# Altium schematic sheet moi.SchDoc
size A3; SheetNumber: 1; SheetTotal: 1
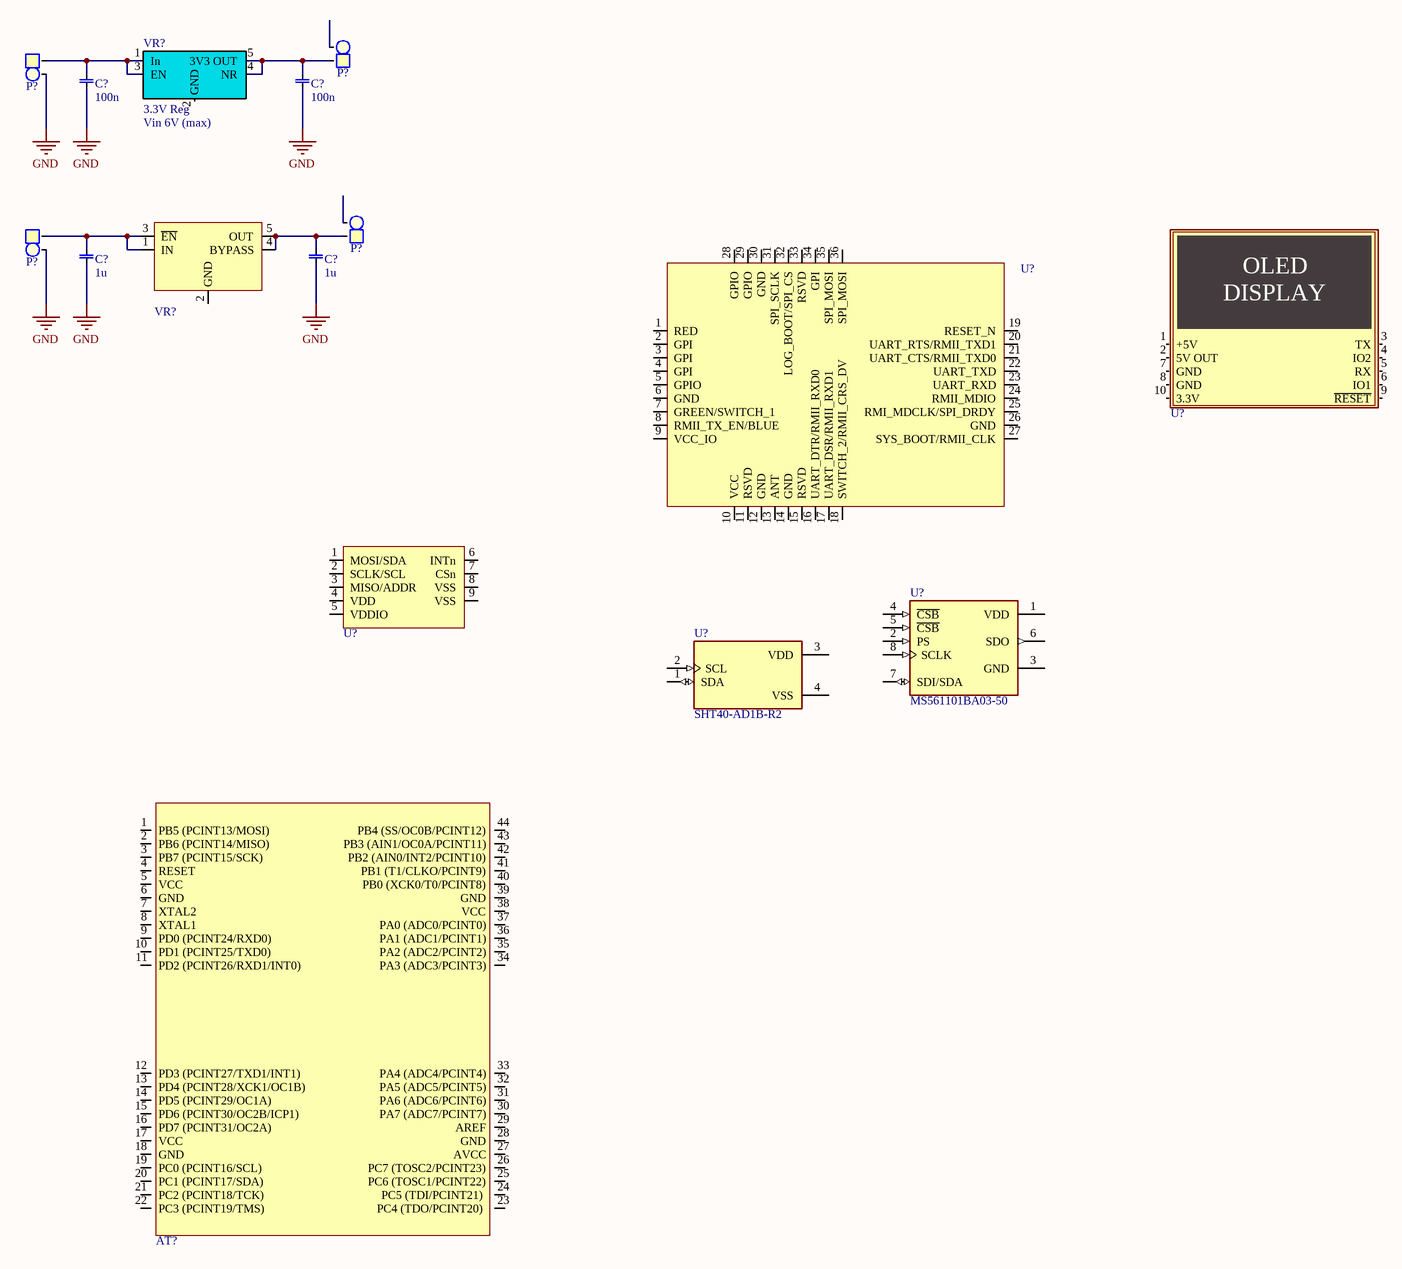
[diagram p0: moi.SchDoc]

## Parts
(Parts that share a designator on the sheet are numbered #1, #2 ... from top to bottom, then left to right.)
AT?  ATmega1284_TQFP  [TQFP-44]  (value not drawn)
C?#1  value 100n  [1206, capasitor]  (hidden comment: 1206, capacitor)
C?#2  value 100n  [1206, capasitor]  (hidden comment: 1206, capacitor)
C?#3  value 1u  [1206, capasitor]  (hidden comment: 1206, capacitor)
C?#4  value 1u  [1206, capasitor]  (hidden comment: 1206, capacitor)
P?#1  1x2 Pin Header  [padtwo_L]  (value not drawn)
P?#2  1x2 Pin Header  [padtwo_L]  (value not drawn)
P?#3  1x2 Pin Header  [padtwo_L]  (value not drawn)
P?#4  1x2 Pin Header  [padtwo_L]  (value not drawn)
U?#1  uOLED-128G2  [uOLED-128G2]  (value not drawn)
U?#2  NINA-W132  [XCVR_NINA-W102]  (value not drawn)
U?#3  MS561101BA03-50  [SON125P500X300X100-8N]
U?#4  SHT40-AD1B-R2  [XDCR_SHT40-AD1B-R2]
U?#5  ENS160  [ENS160]  (value not drawn)
VR?#1  3.3V Reg  Input Voltage: Vin 6V (max)  [SOT23-5]
VR?#2  TPS79118  [SOT95P280X145-5N]  (value not drawn)

## Nets
GND: C?#1.0 C?#2.0 C?#3.0 C?#4.0 P?#2.2 P?#4.2
NetC?#1_1: C?#1.1 P?#2.1 VR?#1.1(In) VR?#1.3(EN)
NetC?#2_1: C?#2.1 P?#1.1 VR?#1.4(NR) VR?#1.5(3V3_OUT)
NetC?#3_1: C?#3.1 P?#4.1 VR?#2.1(IN) VR?#2.3(~{EN})
NetC?#4_1: C?#4.1 P?#3.1 VR?#2.4(BYPASS) VR?#2.5(OUT)

Not connected (* = marked no-connect by the designer): AT? 1(PB5_(PCINT13/MOSI)_) 2(PB6_(PCINT14/MISO)_) 3(PB7_(PCINT15/SCK)_) 4(RESET) 5(VCC) 6(GND) 7(XTAL2) 8(XTAL1) 9(PD0_(PCINT24/RXD0)_) 10(PD1_(PCINT25/TXD0)_) 11(PD2_(PCINT26/RXD1/INT0)_) 12(PD3_(PCINT27/TXD1/INT1)_) 13(PD4_(PCINT28/XCK1/OC1B)_) 14(PD5_(PCINT29/OC1A)_) 15(PD6_(PCINT30/OC2B/ICP1)_) 16(PD7_(PCINT31/OC2A)_) 17(VCC) 18(GND) 19(PC0_(PCINT16/SCL)_) 20(PC1_(PCINT17/SDA)_) 21(PC2_(PCINT18/TCK)_) 22(PC3_(PCINT19/TMS)_) 23(PC4_(TDO/PCINT20)_) 24(PC5_(TDI/PCINT21)_) 25(PC6_(TOSC1/PCINT22)) 26(PC7_(TOSC2/PCINT23)) 27(AVCC) 28(GND) 29(AREF) 30(PA7_(ADC7/PCINT7)) 31(PA6_(ADC6/PCINT6)) 32(PA5_(ADC5/PCINT5)) 33(PA4_(ADC4/PCINT4)) 34(PA3_(ADC3/PCINT3)) 35(PA2_(ADC2/PCINT2)) 36(PA1_(ADC1/PCINT1)) 37(PA0_(ADC0/PCINT0)) 38(VCC) 39(GND) 40(PB0_(XCK0/T0/PCINT8)) 41(PB1_(T1/CLKO/PCINT9)) 42(PB2_(AIN0/INT2/PCINT10)) 43(PB3_(AIN1/OC0A/PCINT11)) 44(PB4_(SS/OC0B/PCINT12)); P?#1 2; P?#3 2; U?#1 1(+5V) 2(5V_OUT) 3(TX) 4(IO2) 5(RX) 6(IO1) 7(GND) 8(GND) 9(~{RESET}) 10(3.3V); U?#2 1(RED) 2(GPI) 3(GPI) 4(GPI) 5(GPIO) 6(GND) 7(GREEN/SWITCH_1) 8(RMII_TX_EN/BLUE) 9(VCC_IO) 10(VCC) 11(RSVD) 12(GND) 13(ANT) 14(GND) 15(RSVD) 16(UART_DTR/RMII_RXD0) 17(UART_DSR/RMII_RXD1) 18(SWITCH_2/RMII_CRS_DV) 19(RESET_N) 20(UART_RTS/RMII_TXD1) 21(UART_CTS/RMII_TXD0) 22(UART_TXD) 23(UART_RXD) 24(RMII_MDIO) 25(RMI_MDCLK/SPI_DRDY) 26(GND) 27(SYS_BOOT/RMII_CLK) 28(GPIO) 29(GPIO) 30(GND) 31(SPI_SCLK) 32(LOG_BOOT/SPI_CS) 33(RSVD) 34(GPI) 35(SPI_MOSI) 36(SPI_MOSI); U?#3 1(VDD) 2(PS) 3(GND) 4(~{CSB}) 5(~{CSB}) 6(SDO) 7(SDI/SDA) 8(SCLK); U?#4 1(SDA) 2(SCL) 3(VDD) 4(VSS); U?#5 1(MOSI/SDA) 2(SCLK/SCL) 3(MISO/ADDR) 4(VDD) 5(VDDIO) 6(INTn) 7(CSn) 8(VSS) 9(VSS); VR?#1 2(GND); VR?#2 2(GND)

## Notes on the sheet
- (in symbol uOLED-128G2) OLED; DISPLAY

## Library data of the parts
AT? = ATmega1284_TQFP: ATmega1284 - TQFP44; Value: ATmega644PA; Farnell: 2484915
P?#1-P?#4 = 1x2 Pin Header: 2.54 mm, TH; Value: 1x2 Pin Header
U?#1 = uOLED-128G2: Value: OLED-Display; Farnell: 2316038
U?#3 = MS561101BA03-50: Pressure Sensor 1.44V to 3.6V 0.01bar to 1.2bar Absolute 8-Pin QFN T/R; MF: TE Connectivity; Package: SMD-8 TE Connectivity; Value: *; TE_purchase_URL: https://www.te.com/usa-en/product-MS561101BA03-50.html?te_bu=Cor&te_type=disp&te_campaign=seda_glo_cor-seda-global-disp-prtnr-fy19-seda-model-bom-cta_sma-317_1&elqCampaignId=32493; EU_RoHS_Compliance: Compliant; Availability: Unavailable; SnapEDA_Link: https://www.snapeda.com/parts/MS561101BA03-50/TE%20Connectivity%20ALCOSWITCH%20Switches/view-part/213247/?ref=snap; Price: None; MP: MS561101BA03-50
U?#4 = SHT40-AD1B-R2: Humidity Temperature Sensor 0 ~ 100% RH Digital Â±1.8% RH Surface Mount; MF: Sensirion; Availability: In Stock; Price: None; Package: WDFN-4 Sensirion; MP: SHT40-AD1B-R2; Value: *; SnapEDA_Link: https://www.snapeda.com/parts/SHT40-AD1B-R2/Sensirion/view-part/5161667/?ref=snap; Check_prices: https://www.snapeda.com/parts/SHT40-AD1B-R2/Sensirion/view-part/5161667/?ref=eda; Purchase-URL: https://pricing.snapeda.com/search/part/SHT40-AD1B-R2/?ref=eda
VR?#1 = TPS79333DBR: 3.3V Reg, Ultra-Low Noise, 200 mA; Value: TPS79333DBVR; Drop Out: 102mV; Farnell: 1287689
VR?#2 = TPS79118: LDO Voltage Regulator